# Altium schematic sheet 3_Communication.SchDoc
size A4; SheetNumber: 3; SheetTotal: 4
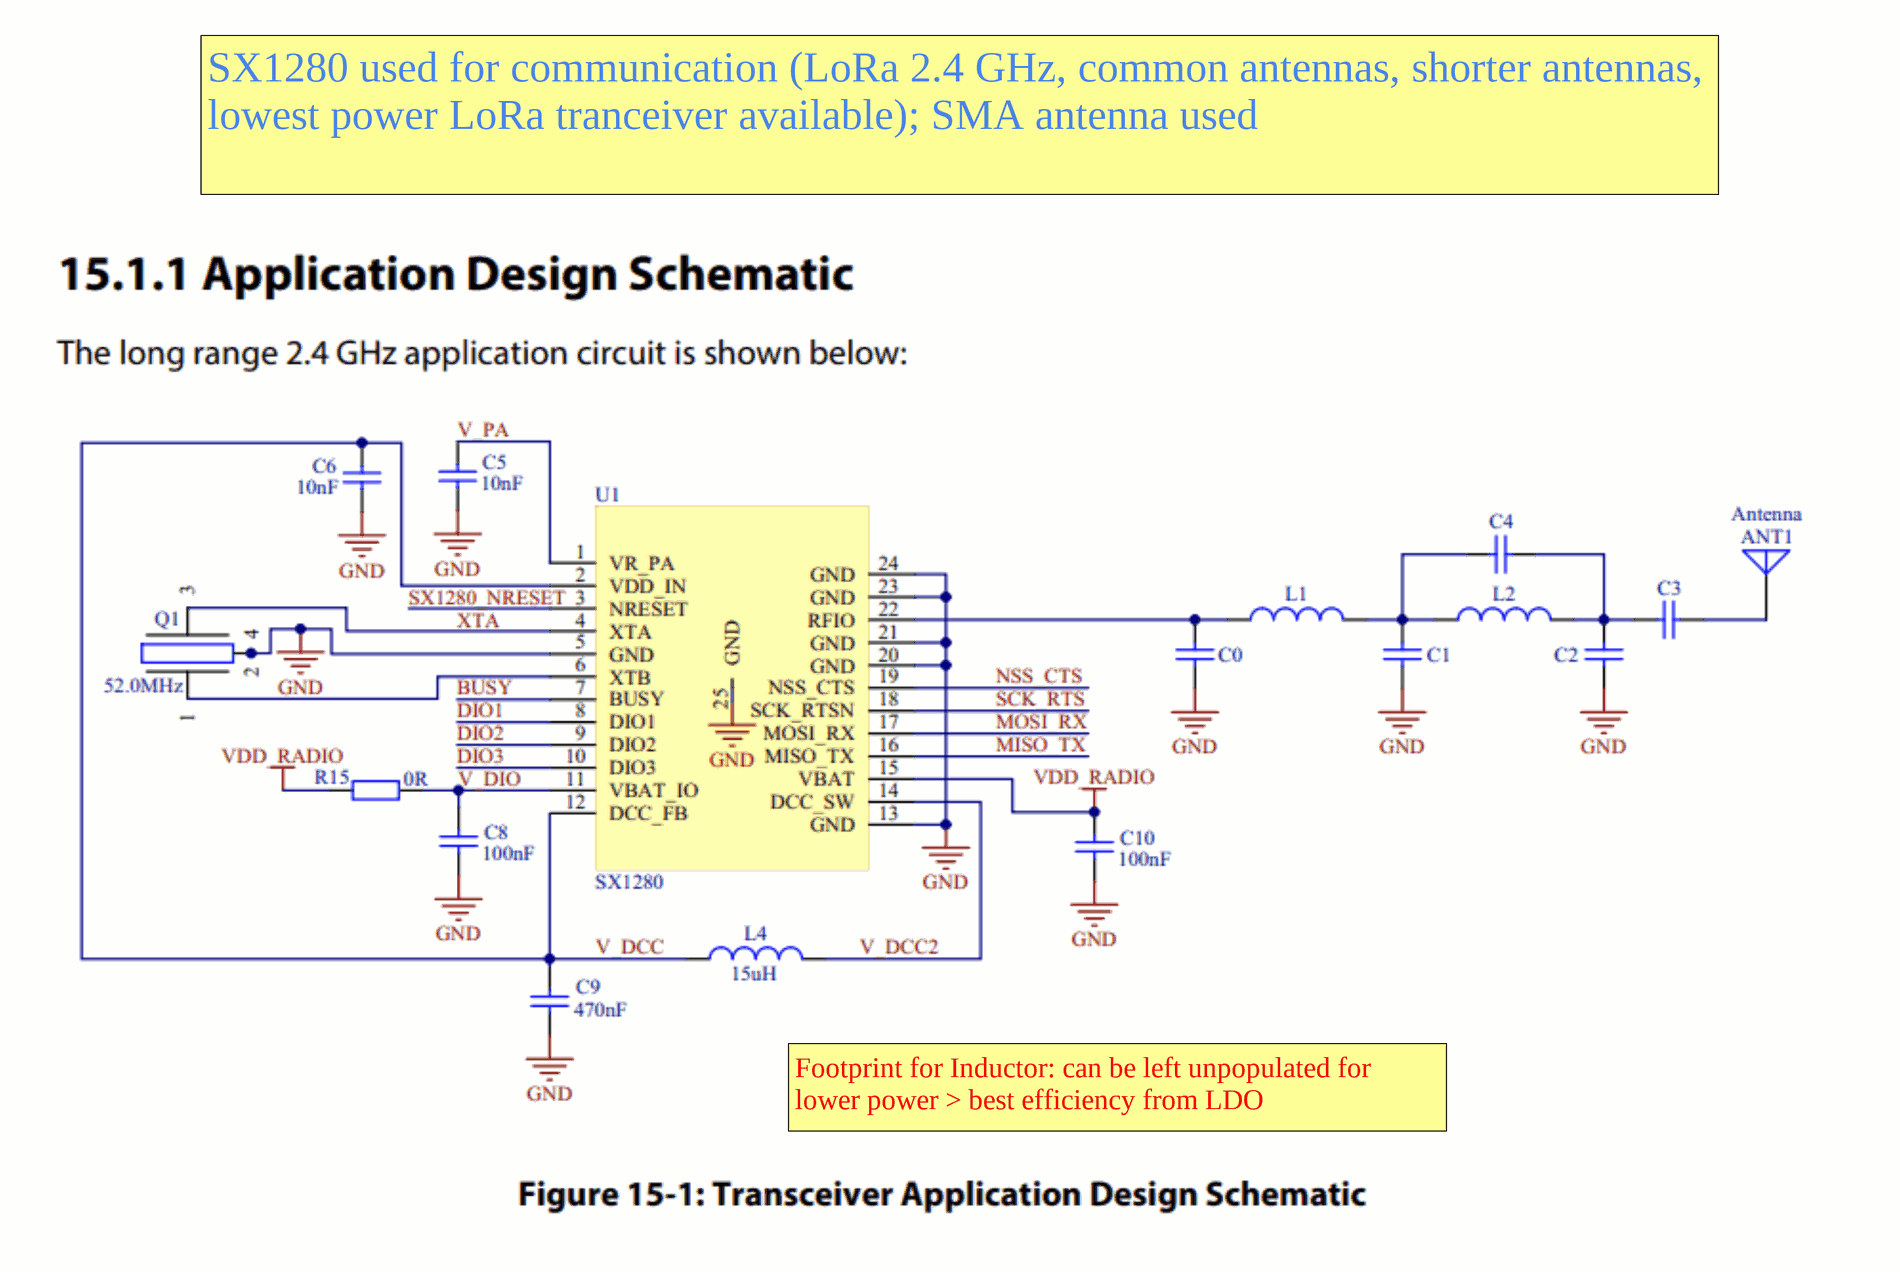
[diagram p0: 3_Communication.SchDoc, left]
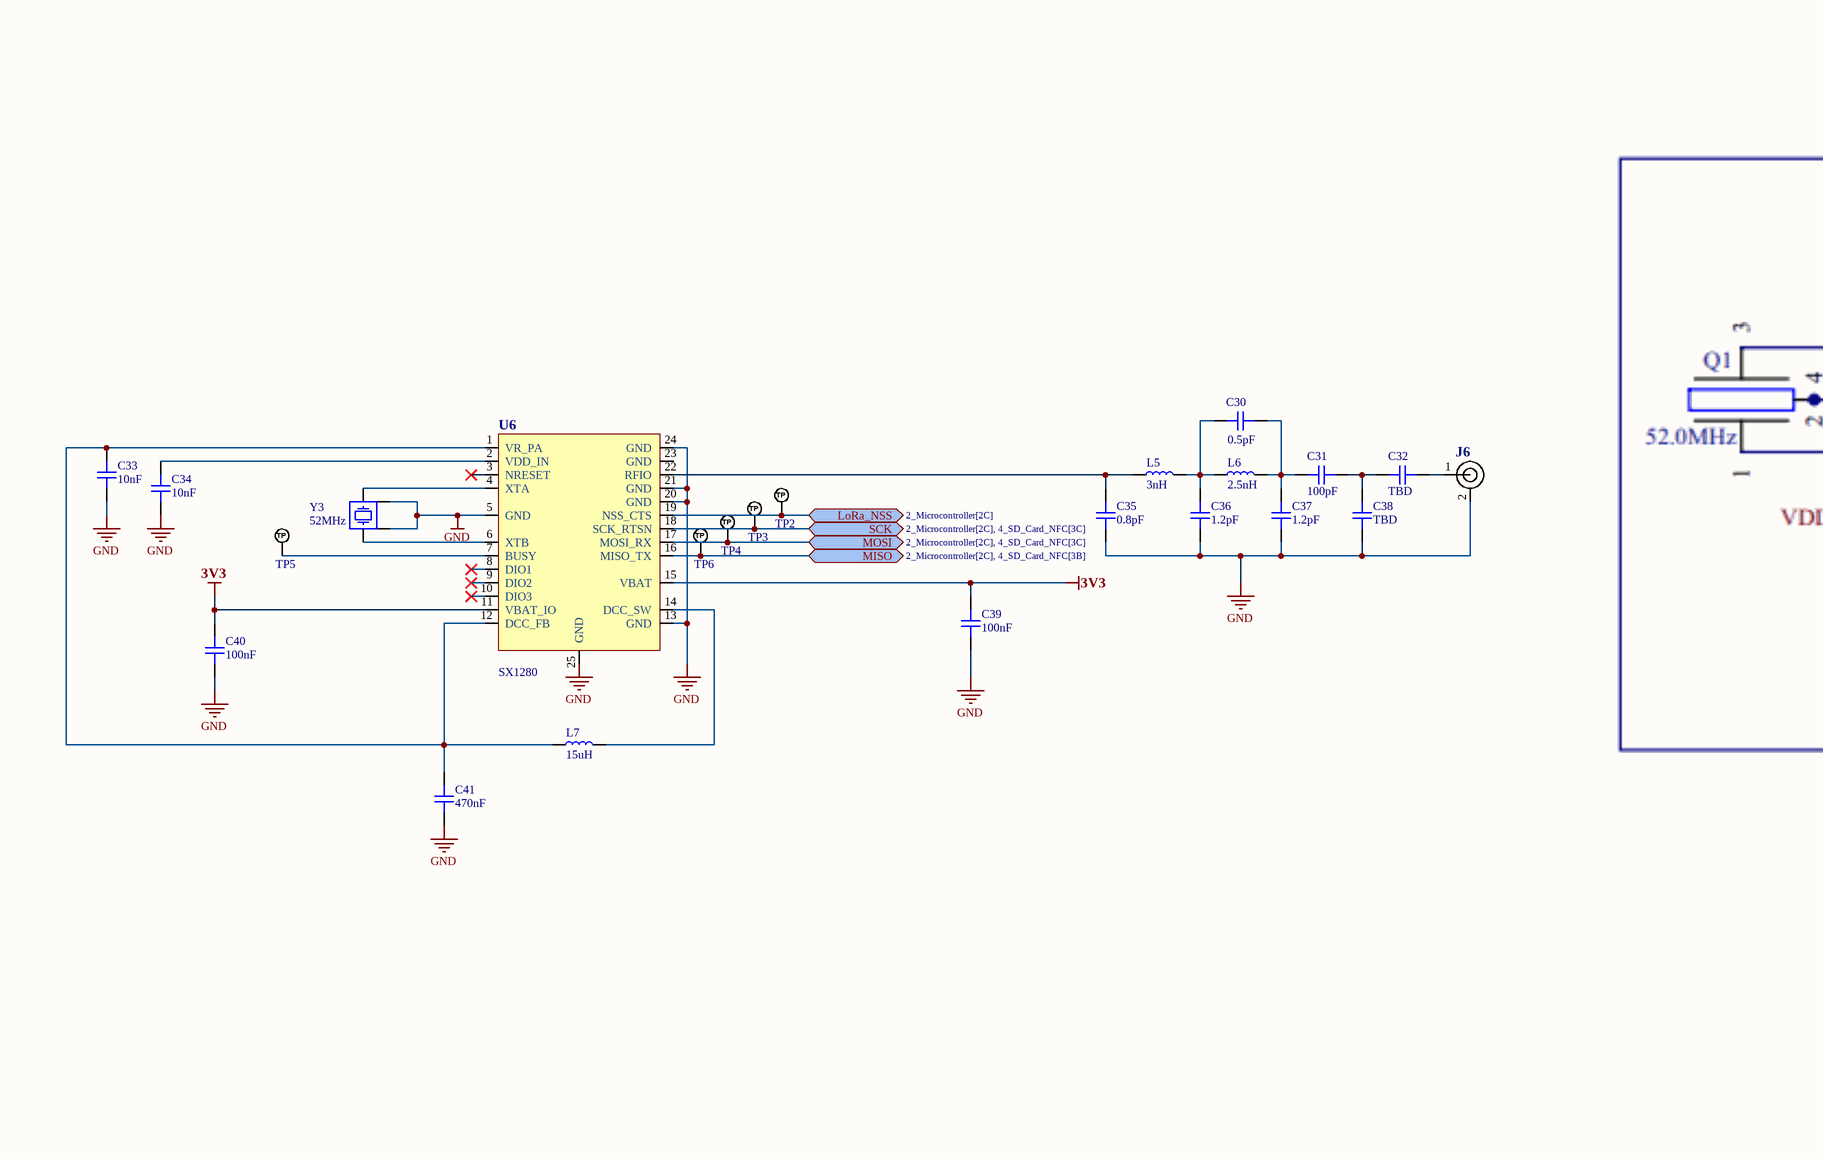
[diagram p1: 3_Communication.SchDoc, middle]
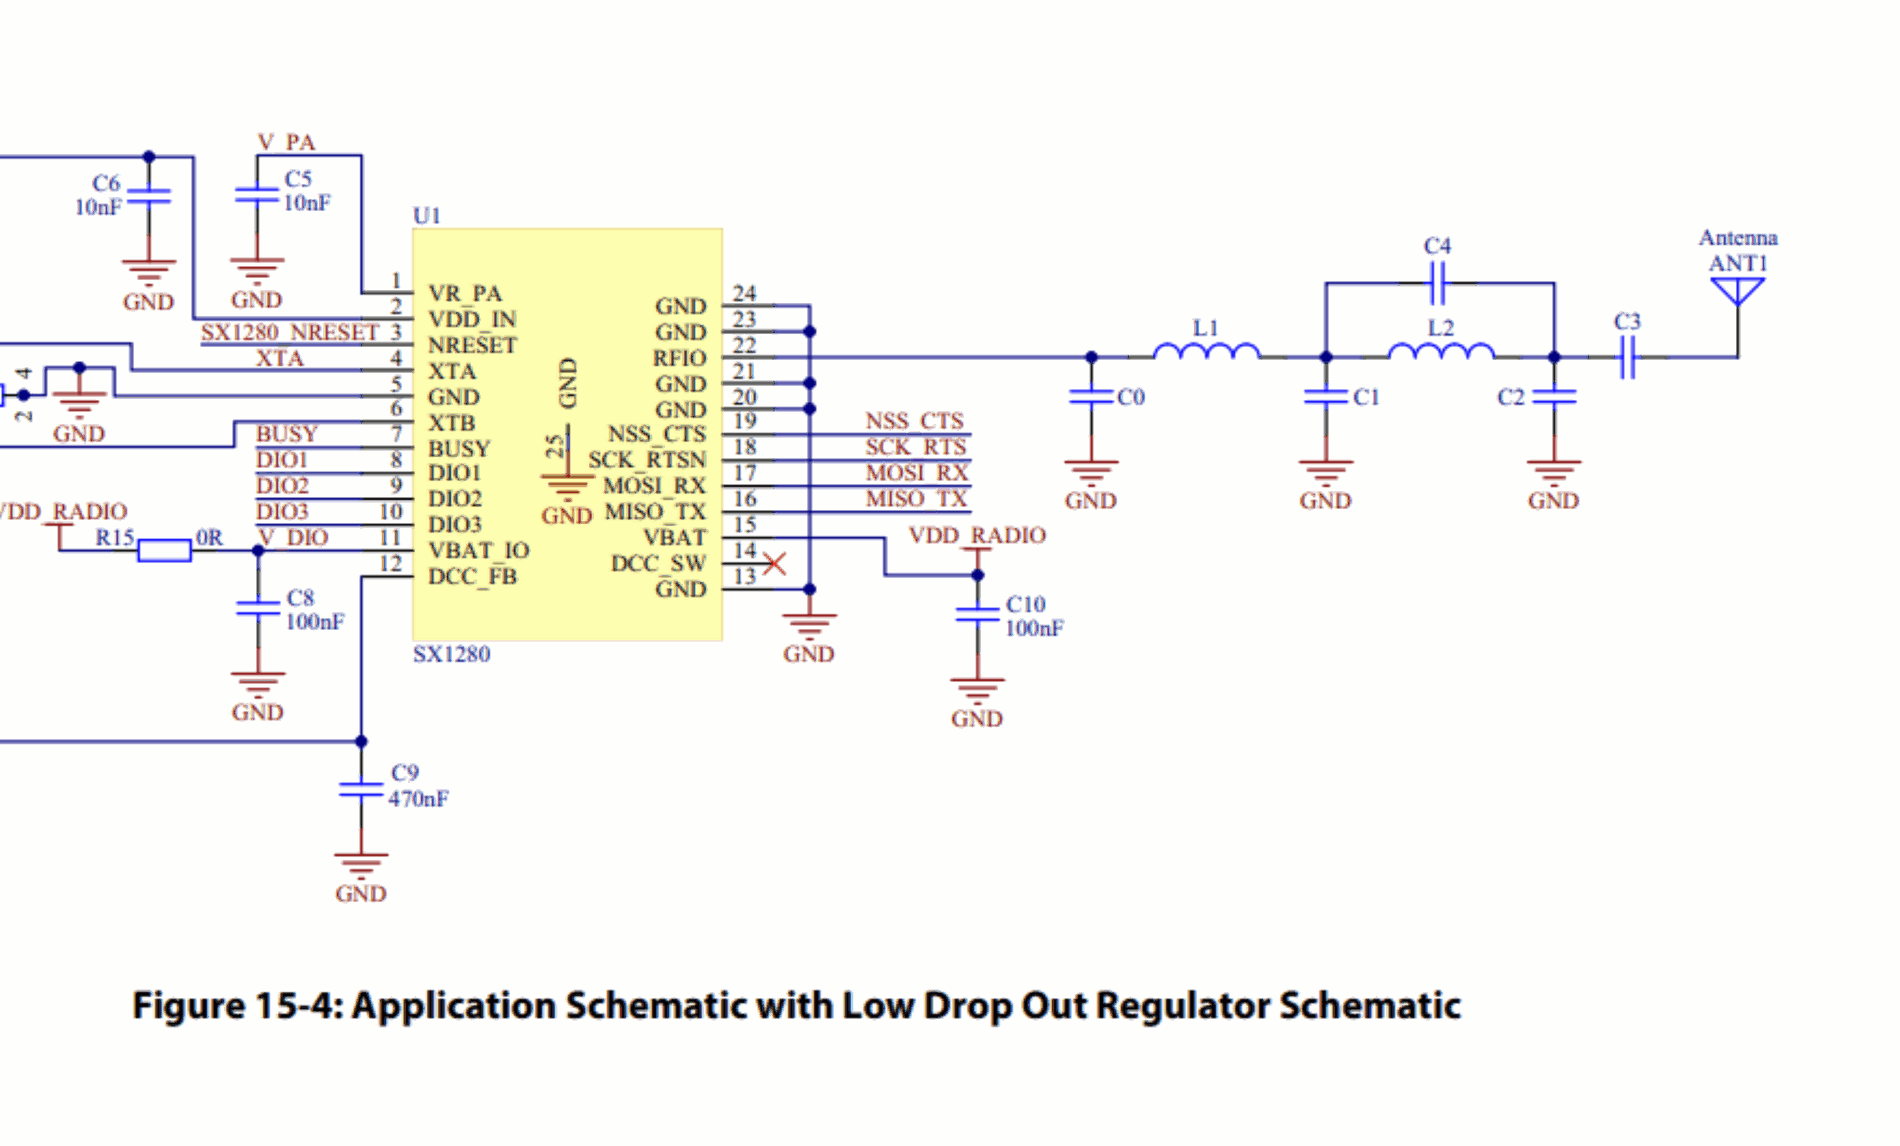
[diagram p2: 3_Communication.SchDoc, right]

## Parts
C30  0.5pF  [C0603]
C31  100pF  [C0603]
C32  TBD  [C0603]
C33  10nF  [C0603]
C34  10nF  [C0603]
C35  0.8pF  [C0603]
C36  1.2pF  [C0603]
C37  1.2pF  [C0603]
C38  TBD  [C0603]
C39  100nF  [C0603]
C40  100nF  [C0603]
C41  470nF  [C0603]
J6  SMA_EDGE_CONN  [CON_SMA-EDGE-S]  (value not drawn)
L5  3nH  [L0603]
L6  2.5nH  [L0603]
L7  15uH  [IND_3.2_4]
TP2  TP_NOBOM  [TEST_PAD_THD]  (value not drawn)  (no BOM)
TP3  TP_NOBOM  [TEST_PAD_THD]  (value not drawn)  (no BOM)
TP4  TP_NOBOM  [TEST_PAD_THD]  (value not drawn)  (no BOM)
TP5  TP_NOBOM  [TEST_PAD_THD]  (value not drawn)  (no BOM)
TP6  TP_NOBOM  [TEST_PAD_THD]  (value not drawn)  (no BOM)
U6  SX1280  [QFN-24_4x4_0.5]
Y3  52MHz  [CRYSTAL_2016_4P]

## Ports
LoRa_NSS (bidir, see 2_Microcontroller[2C]), MISO (bidir, see 2_Microcontroller[2C], 4_SD_Card_NFC[3B]), MOSI (bidir, see 2_Microcontroller[2C], 4_SD_Card_NFC[3C]), SCK (bidir, see 2_Microcontroller[2C], 4_SD_Card_NFC[3C])

## Nets
3V3: C39.2 C40.2 U6.11(VBAT_IO) U6.15(VBAT)
GND: C33.1 C34.1 C35.1 C36.1 C37.1 C38.1 C39.1 C40.1 C41.1 J6.2 U6.5(GND) U6.13(GND) U6.20(GND) U6.21(GND) U6.24(GND) U6.25(GND) Y3.2 Y3.4
LoRa_NSS: TP2.1(TP) U6.19(NSS_CTS) ; port LoRa_NSS
MISO: TP6.1(TP) U6.16(MISO_TX) ; port MISO
MOSI: TP4.1(TP) U6.17(MOSI_RX) ; port MOSI
SCK: TP3.1(TP) U6.18(SCK_RTSN) ; port SCK
NetC30_1: C30.1 C31.2 C37.2 L6.2
NetC30_2: C30.2 C36.2 L5.2 L6.1
NetC31_1: C31.1 C32.2 C38.2
NetC32_1: C32.1 J6.1
NetC33_2: C33.2 C41.2 L7.1 U6.1(VR_PA) U6.12(DCC_FB)
NetC34_2: C34.2 U6.2(VDD_IN)
NetC35_2: C35.2 L5.1 U6.22(RFIO)
NetL7_2: L7.2 U6.14(DCC_SW)
NetTP5_1: TP5.1(TP) U6.7(BUSY)
NetU6_4: U6.4(XTA) Y3.3
NetU6_6: U6.6(XTB) Y3.1

Not connected (* = marked no-connect by the designer): U6 3(NRESET)* 8(DIO1)* 9(DIO2)* 10(DIO3)* 23(GND)

## Notes on the sheet
- SX1280 used for communication (LoRa 2.4 GHz, common antennas, shorter antennas, lowest power LoRa tranceiver available); SMA antenna used
- impedance matching configurations(40R to 50R after C25)
- last 2 capacitors are for impedance matching for certain antenna
- Values based on antenna input impedance; capacitors to ground can be left unpopullated, inductors or series capacitors can be swaped with 0R resistors or shunts
- Footprint for Inductor: can be left unpopulated for lower power > best efficiency from LDO

## Library data of the parts
C30 C31 C33 C34 C36 C37 C39-C41 = CAP_0603: Capacitor SMD 0603; Manufacturer: *; Manufacturer Part Number: *; Distributor Link: *; LCSC: *; Rating: *; Dielectric: *
C32 C38 = CAP_0603: Capacitor SMD 0805; Manufacturer: *; Manufacturer Part Number: *; Distributor Link: *; LCSC: *; Rating: *; Dielectric: *
C35 = CAP_0805: Capacitor SMD 0805; Manufacturer: *; Manufacturer Part Number: *; Distributor Link: *; LCSC: *; Rating: *; Dielectric: *
J6 = CON-SMA-EDGE-S: RF Connector SMA Female 50 Ohms 18 GHz PCB Edge Mount; Manufacturer: RF Solutions; Manufacturer Part Number: CON-SMA-EDGE-S
L5-L7 = IND_0603: Inductor SMD 0603
TP2-TP6 = TEST_POINT_RND_1MM: Test Point Round 1mm (NO BOM)
U6 = SX1280: Low power LoRa transceiver operating at 2.4GHz with ranging capability
Y3 = Crystal: Manufacturer: Epson; Manufacturer Part Number: TSX-3225 24.0000MF15X-AC